# Altium schematic sheet Sheet1.SchDoc
size A4; SheetNumber: 8; SheetTotal: 8
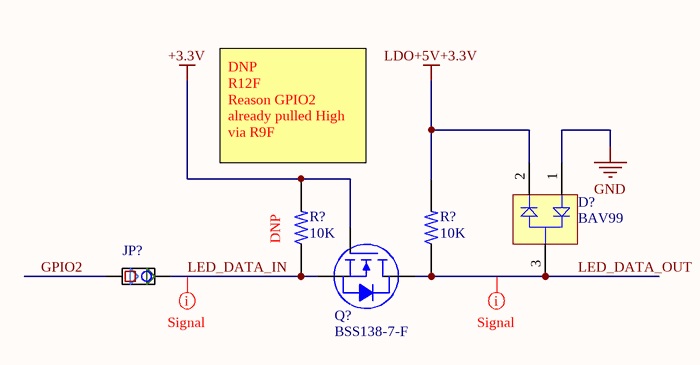
[diagram p0: Sheet1.SchDoc]

## Parts
(Parts that share a designator on the sheet are numbered #1, #2 ... from top to bottom, then left to right.)
D?  BAV99  [INF-SOT23_N]
JP?  Solder Pad  [Solder_Pad_2_Pin_NC_Small]  (value not drawn)
Q?  BSS138-7-F  [DIODES SOT-23-3]
R?#1  10K  [R-0603]
R?#2  10K  [R-0603]

## Nets
+3.3V: Q?.1(G) R?#1.2
GND: D?.1(A1)
LDO+5V+3.3V: D?.2(K2) R?#2.2
GPIO2: JP?.1
LED_DATA_IN: JP?.2 Q?.2(S) R?#1.1
LED_DATA_OUT: D?.3(C) Q?.3(D) R?#2.1

## Layout directives
net class Signal: LED_DATA_IN, LED_DATA_OUT

## Notes on the sheet
- (near R?#1) DNP
  R12F
  Reason GPIO2 already pulled High via R9F
- (near R?#1) DNP

## Library data of the parts
D? = CMP-1176-00014-1: Silicon Switching Diode, SOT23, Reel, Green; Manufacturer: Infineon; Green: TRUE; Mounting Technology: Surface Mount; ComponentLink3URL: http://www.infineon.com/dgdl/smbta14_mmbta14.pdf?folderId=db3a30431441fb5d011445c30f210183&fileId=db3a30431441fb5d011445ef0201018c; PartNumber: BAV99; ComponentLink2Description: Datasheet; ComponentLink2URL: http://www.infineon.com/dgdl/bav99series.pdf?folderId=db3a30431400ef6801141b5844e103ea&fileId=db3a30431400ef6801141c1b237d042f; PackageVersion: Apr-08; PackageDescription: 3-Pin Small Outline Transistor Package, 1.3 x 2.9 mm Body, 0.95 mm Pitch; RevisionNote: Re-Activated Devices; ComponentLink1URL: http://www.infineon.com/; PackageReference: SOT23; ComponentLink1Description: Manufacturer URL; ComponentLink3Description: Package Specification; Packing: Reel
JP? = Solder_Pad_2_Pin_NC_Small: Solder Pad 2 Pin NC 0.762 mm Pitch
Q? = BSS138-7-F: MOSFET N-CH 50V 200MA SOT23-3; Manufacturer: Diodes Incorporated; Current - Continuous Drain (Id) @ 25°C: 200mA (Ta); Drive Voltage (Max Rds On,  Min Rds On): 10V; FET Type: N-Channel; Input Capacitance (Ciss) (Max) @ Vds: 50pF @ 10V; Power Dissipation (Max): 300mW (Ta); Rds On (Max) @ Id, Vgs: 3.5Ohm @ 220mA, 10V; Vgs (Max): ±20V; Vgs(th) (Max) @ Id: 1.5V @ 250µA; Part Number: BSS138-7-F; ComponentLink1Description: Datasheet; ComponentLink1URL: https://www.diodes.com/assets/Datasheets/ds30144.pdf; ComponentLink2Description: DigiKey Link; ComponentLink2URL: http://digikey.com/product-detail/en/diodes-incorporated/BSS138-7-F/BSS138-FDICT-ND/717843; Drain to Source Voltage (Vdss): 50V; LastUpdated: 19-09-2022 02:00:14 PM; Lifecycle Status: Active; Minimum Order: 1; Mounting Type: Surface Mount; Operating Temperature: -55°C ~ 150°C (TJ); Package / Case: TO-236-3, SC-59, SOT-23-3; Packaging: TapeAndReel; Part Status: Active; Price: 0.04; Series: -; Supplier 1: DigiKey; Supplier Part Number 1: BSS138-FDICT-ND; Supplier Device Package: SOT-23-3; Technology: MOSFET (Metal Oxide)
R?#1 R?#2 = R-0603: 0603; MP: 2-1623703-0; Power_Rating: .1 W; Tolerance: 1%; MF: TE Connectivity; Value: 10K; Package: 0603; Price: None; Resistance: 10K; Check_prices: https://www.snapeda.com/parts/2-1623703-0/TE%20Connectivity/view-part/2213192/?ref=eda; SnapEDA_Link: https://www.snapeda.com/parts/2-1623703-0/TE%20Connectivity/view-part/2213192/?ref=snap; Availability: Warning